# Altium schematic sheet Teensywpinsfinal.SchDoc
size C
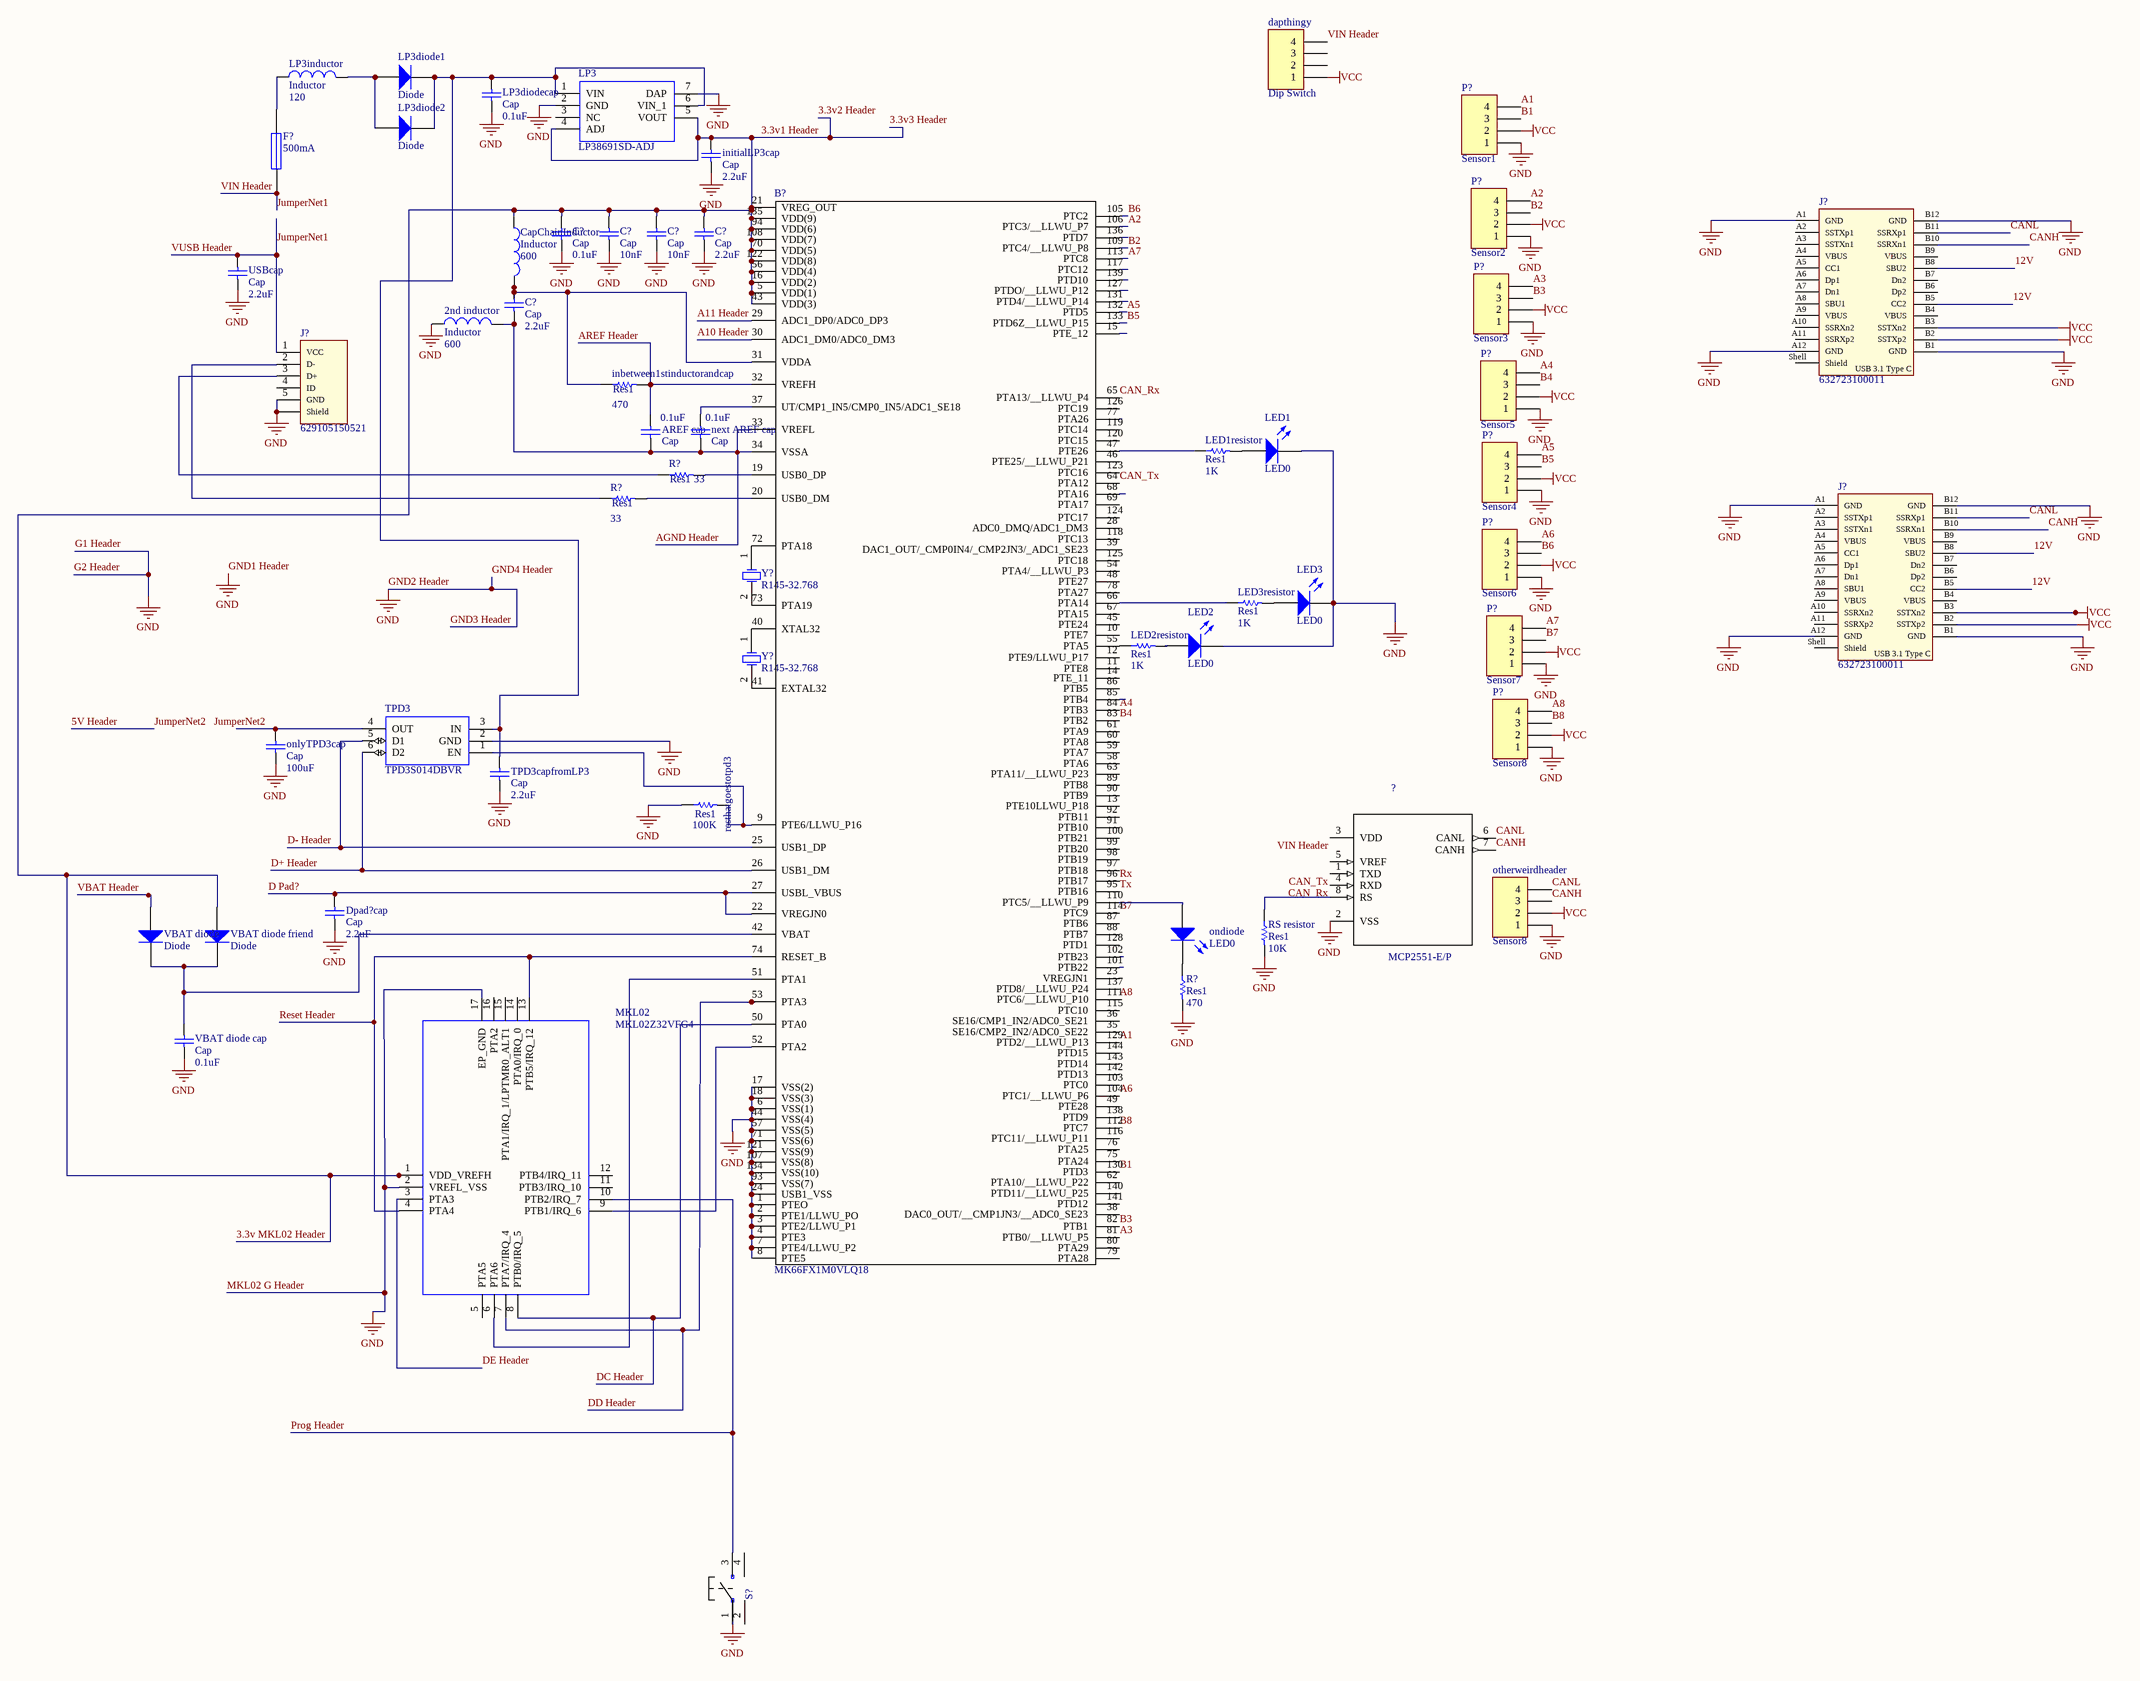
[diagram p0: Teensywpinsfinal.SchDoc]

## Parts
(Parts that share a designator on the sheet are numbered #1, #2 ... from top to bottom, then left to right.)
2nd_inductor  Inductor  value 600  [INDC5041X06N]
?  MCP2551-E/P  [SOIC127P600X175-8N]
AREF_cap  Cap  value 0.1uF  [CAPC2012X06N]
B?  MK66FX1M0VLQ18  [QFP50P2200X2200X160-144N]
C?#1  Cap  value 0.1uF  [CAPC2012X06N]
C?#2  Cap  value 10nF  [CAPC2012X06N]
C?#3  Cap  value 10nF  [CAPC2012X06N]
C?#4  Cap  value 2.2uF  [CAPC2012X06N]
C?#5  Cap  value 2.2uF  [CAPC2012X06N]
CapChainInductor  Inductor  value 600  [INDC5041X06N]
dapthingy  Dip Switch  [SOP254P1020X947-4N]
Dpad?cap  Cap  value 2.2uF  [CAPC2012X06N]
F?  500mA  [CAPC1608X06N]
inbetween1stinductorandcap  Res1  value 470  [CAPC1005X06N]
initialLP3cap  Cap  value 2.2uF  [CAPC2012X06N]
J?#1  632723100011  [632723100011]
J?#2  629105150521  [629105150521]
J?#3  632723100011  [632723100011]
LED1  LED0  [0603]
LED1resistor  Res1  value 1K  [CAPC1005X04N]
LED2  LED0  [0603]
LED2resistor  Res1  value 1K  [CAPC1005X04N]
LED3  LED0  [0603]
LED3resistor  Res1  value 1K  [CAPC1005X04N]
LP3  LP38691SD-ADJ  [SON95P300X300X80-7N]
LP3diode1  Diode  [SODFL370X105-2N]
LP3diode2  Diode  [SODFL370X105-2N]
LP3diodecap  Cap  value 0.1uF  [CAPC2012X06N]
LP3inductor  Inductor  value 120  [CAPC1608X06N]
MKL02  MKL02Z32VFG4  [QFN50P300X300X65-17N-D]
next_AREF_cap  Cap  value 0.1uF  [CAPC2012X06N]
ondiode  LED0  [0603]
onlyTPD3cap  Cap  value 100uF  [CAPC2012X06N]
otherweirdheader  Sensor8  [HDR1X4]
P?#1  Sensor1  [HDR1X4]
P?#2  Sensor2  [HDR1X4]
P?#3  Sensor3  [HDR1X4]
P?#4  Sensor5  [HDR1X4]
P?#5  Sensor4  [HDR1X4]
P?#6  Sensor6  [HDR1X4]
P?#7  Sensor7  [HDR1X4]
P?#8  Sensor8  [HDR1X4]
R?#1  Res1  value 33  [CAPC1005X06N]
R?#2  Res1  value 33  [CAPC1005X06N]
R?#3  Res1  value 470  [CAPC1005X06N]
resthatgoestotpd3  Res1  value 100K  [CAPC1005X06N]
RS_resistor  Res1  value 10K  [CAPC1005X04N]
S?  TL3315NF100Q  [TL3315NF100Q]  (value not drawn)
TPD3  TPD3S014DBVR  [SOT95P280X145-6N]
TPD3capfromLP3  Cap  value 2.2uF  [CAPC2012X06N]
USBcap  Cap  value 2.2uF  [CAPC2012X06N]
VBAT_diode  Diode  [SODFL370X105-2N]
VBAT_diode_cap  Cap  value 0.1uF  [CAPC2012X06N]
VBAT_diode_friend  Diode  [SODFL370X105-2N]
Y?#1  R145-32.768  [R145]
Y?#2  R145-32.768  [R145]

## Nets
G1 Header: 2nd_inductor.1 ?.2(VSS) B?.1(PTEO) B?.2(PTE1/LLWU_PO) B?.3(PTE2/LLWU_P1) B?.4(PTE3) B?.6(VSS(1)) B?.7(PTE4/LLWU_P2) B?.8(PTE5) B?.17(VSS(2)) B?.18(VSS(3)) B?.24(USB1_VSS) B?.44(VSS(4)) B?.57(VSS(5)) B?.71(VSS(6)) B?.93(VSS(7)) B?.107(VSS(8)) B?.121(VSS(9)) B?.134(VSS(10)) C?#1.2 C?#2.2 C?#3.2 C?#4.2 Dpad?cap.2 initialLP3cap.2 J?#1.A1(GND) J?#1.A12(GND) J?#1.B1(GND) J?#1.B12(GND) J?#2.5(GND) J?#2.Shell(Shield) J?#3.A1(GND) J?#3.A12(GND) J?#3.B1(GND) J?#3.B12(GND) LED1.2(K) LED2.2(K) LED3.2(K) LP3.2(GND) LP3.7(DAP) LP3diodecap.2 MKL02.2(VREFL_VSS) MKL02.17(EP_GND) onlyTPD3cap.2 otherweirdheader.1 P?#1.1 P?#2.1 P?#3.1 P?#4.1 P?#5.1 P?#6.1 P?#7.1 P?#8.1 R?#3.2 resthatgoestotpd3.1 RS_resistor.2 S?.1(P$1) TPD3.2(GND) TPD3capfromLP3.2 USBcap.2 VBAT_diode_cap.2  [also labelled G2 Header, GND, GND1 Header, GND2 Header, GND3 Header, GND4 Header, MKL02 G Header]
VCC: dapthingy.1 J?#1.B2(SSTXp2) J?#1.B3(SSTXn2) J?#3.B2(SSTXp2) J?#3.B3(SSTXn2) otherweirdheader.2 P?#1.2 P?#2.2 P?#3.2 P?#4.2 P?#5.2 P?#6.2 P?#7.2 P?#8.2
3.3v MKL02 Header: B?.5(VDD(1)) B?.16(VDD(2)) B?.21(VREG_OUT) B?.43(VDD(3)) B?.56(VDD(4)) B?.70(VDD(5)) B?.94(VDD(6)) B?.108(VDD(7)) B?.122(VDD(8)) B?.135(VDD(9)) C?#1.1 C?#2.1 C?#3.1 C?#4.1 CapChainInductor.1 initialLP3cap.1 LP3.4(ADJ) LP3.5(VOUT) MKL02.1(VDD_VREFH) VBAT_diode_friend.1(A)  [also labelled 3.3v1 Header, 3.3v2 Header, 3.3v3 Header]
12V: J?#1.B5(CC2) J?#1.B8(SBU2) J?#3.B5(CC2) J?#3.B8(SBU2)
A1: B?.129(PTD2/__LLWU_P13) P?#1.4
A2: B?.106(PTC3/__LLWU_P7) P?#2.4
A3: B?.81(PTB0/__LLWU_P5) P?#3.4
A4: B?.84(PTB3) P?#4.4
A5: B?.132(PTD5) P?#5.4
A6: B?.104(PTC1/__LLWU_P6) P?#6.4
A7: B?.113(PTC8) P?#7.4
A8: B?.111(PTC6/__LLWU_P10) P?#8.4
A10 Header: B?.30(ADC1_DM0/ADC0_DM3)
A11 Header: B?.29(ADC1_DP0/ADC0_DP3)
AGND Header: 2nd_inductor.2 AREF_cap.2 B?.33(VREFL) B?.34(VSSA) C?#5.2 next_AREF_cap.2
AREF Header: AREF_cap.1 B?.32(VREFH) inbetween1stinductorandcap.2
B1: B?.130(PTD3) P?#1.3
B2: B?.109(PTC4/__LLWU_P8) P?#2.3
B3: B?.82(PTB1) P?#3.3
B4: B?.83(PTB2) P?#4.3
B5: B?.133(PTD6Z__LLWU_P15) P?#5.3
B6: B?.105(PTC2) P?#6.3
B7: B?.114(PTC9) P?#7.3
B8: B?.112(PTC7) P?#8.3
CAN_Rx: ?.4(RXD) B?.65(PTA13/__LLWU_P4)
CAN_Tx: ?.1(TXD) B?.64(PTA12)
CANH: ?.7(CANH) J?#1.B10(SSRXn1) J?#3.B10(SSRXn1) otherweirdheader.3
CANL: ?.6(CANL) J?#1.B11(SSRXp1) J?#3.B11(SSRXp1) otherweirdheader.4
D Pad?: B?.22(VREGJN0) B?.27(USBL_VBUS) Dpad?cap.1
D+ Header: B?.26(USB1_DM) TPD3.6(D2)
D- Header: B?.25(USB1_DP) TPD3.5(D1)
DC Header: B?.50(PTA0) MKL02.8(PTB0/IRQ_5)
DD Header: B?.53(PTA3) MKL02.7(PTA7/IRQ_4)
DE Header: MKL02.3(PTA3)
JumperNet1: ?.3(VDD) dapthingy.4 F?.1 J?#2.1(VCC) USBcap.1  [also labelled VIN Header, VUSB Header]
Prog Header: MKL02.10(PTB2/IRQ_7) S?.3(P$2)
Reset Header: B?.74(RESET_B) MKL02.4(PTA4) MKL02.13(PTB5/IRQ_12)
Rx: B?.96(PTB17)
Tx: B?.95(PTB16)
VBAT Header: VBAT_diode.1(A)
Net?_8: ?.8(RS) RS_resistor.1
NetB?_9: B?.9(PTE6/LLWU_P16) resthatgoestotpd3.2 TPD3.1(EN)
NetB?_19: B?.19(USB0_DP) R?#1.2
NetB?_20: B?.20(USB0_DM) R?#2.2
NetB?_31: B?.31(VDDA) C?#5.1 CapChainInductor.2 inbetween1stinductorandcap.1
NetB?_37: B?.37(UT/CMP1_IN5/CMP0_IN5/ADC1_SE18) next_AREF_cap.1
NetB?_40: B?.40(XTAL32) Y?#2.1(OSC1)
NetB?_41: B?.41(EXTAL32) Y?#2.2(OSC2)
NetB?_42: B?.42(VBAT) VBAT_diode.2(K) VBAT_diode_cap.1 VBAT_diode_friend.2(K)
NetB?_47: B?.47(PTE26) LED1resistor.1
NetB?_51: B?.51(PTA1) MKL02.6(PTA6)
NetB?_52: B?.52(PTA2) MKL02.9(PTB1/IRQ_6)
NetB?_55: B?.55(PTA5) LED2resistor.1
NetB?_66: B?.66(PTA14) LED3resistor.1
NetB?_72: B?.72(PTA18) Y?#1.1(OSC1)
NetB?_73: B?.73(PTA19) Y?#1.2(OSC2)
NetB?_110: B?.110(PTC5/__LLWU_P9) ondiode.1(A)
NetF?_2: F?.2 LP3inductor.1
NetJ?#2_2: J?#2.2(D-) R?#2.1
NetJ?#2_3: J?#2.3(D+) R?#1.1
NetLED1_1: LED1.1(A) LED1resistor.2
NetLED2_1: LED2.1(A) LED2resistor.2
NetLED3_1: LED3.1(A) LED3resistor.2
NetLP3_1: LP3.1(VIN) LP3.6(VIN_1) LP3diode1.2(K) LP3diode2.2(K) LP3diodecap.1 TPD3.3(IN) TPD3capfromLP3.1
NetLP3diode1_1: LP3diode1.1(A) LP3diode2.1(A) LP3inductor.2
Netondiode_2: ondiode.2(K) R?#3.1
NetonlyTPD3cap_1: onlyTPD3cap.1 TPD3.4(OUT)

Not connected (* = marked no-connect by the designer): ? 5(VREF); B? 10(PTE7) 11(PTE8) 12(PTE9/LLWU_P17) 13(PTE10LLWU_P18) 14(PTE_11) 15(PTE_12) 23(VREGJN1) 28(ADC0_DMQ/ADC1_DM3) 35(SE16/CMP2_IN2/ADC0_SE22) 36(SE16/CMP1_IN2/ADC0_SE21) 38(DAC0_OUT/__CMP1JN3/__ADC0_SE23) 39(DAC1_OUT/_CMP0IN4/_CMP2JN3/_ADC1_SE23) 45(PTE24) 46(PTE25/__LLWU_P21) 48(PTE27) 49(PTE28) 54(PTA4/__LLWU_P3) 58(PTA6) 59(PTA7) 60(PTA8) 61(PTA9) 62(PTA10/__LLWU_P22) 63(PTA11/__LLWU_P23) 67(PTA15) 68(PTA16) 69(PTA17) 75(PTA24) 76(PTA25) 77(PTA26) 78(PTA27) 79(PTA28) 80(PTA29) 85(PTB4) 86(PTB5) 87(PTB6) 88(PTB7) 89(PTB8) 90(PTB9) 91(PTB10) 92(PTB11) 97(PTB18) 98(PTB19) 99(PTB20) 100(PTB21) 101(PTB22) 102(PTB23) 103(PTC0) 115(PTC10) 116(PTC11/__LLWU_P11) 117(PTC12) 118(PTC13) 119(PTC14) 120(PTC15) 123(PTC16) 124(PTC17) 125(PTC18) 126(PTC19) 127(PTDO/__LLWU_P12) 128(PTD1) 131(PTD4/__LLWU_P14) 136(PTD7) 137(PTD8/__LLWU_P24) 138(PTD9) 139(PTD10) 140(PTD11/__LLWU_P25) 141(PTD12) 142(PTD13) 143(PTD14) 144(PTD15); dapthingy 2 3; J?#1 A2(SSTXp1) A3(SSTXn1) A4(VBUS) A5(CC1) A6(Dp1) A7(Dn1) A8(SBU1) A9(VBUS) A10(SSRXn2) A11(SSRXp2) B4(VBUS) B6(Dp2) B7(Dn2) B9(VBUS) Shell(Shield); J?#2 4(ID); J?#3 A2(SSTXp1) A3(SSTXn1) A4(VBUS) A5(CC1) A6(Dp1) A7(Dn1) A8(SBU1) A9(VBUS) A10(SSRXn2) A11(SSRXp2) B4(VBUS) B6(Dp2) B7(Dn2) B9(VBUS) Shell(Shield); LP3 3(NC); MKL02 5(PTA5) 11(PTB3/IRQ_10) 12(PTB4/IRQ_11) 14(PTA0/IRQ_0) 15(PTA1/IRQ_1/LPTMR0_ALT1) 16(PTA2); S? 2(P$1) 4(P$2)

## Notes on the sheet
- Labels drawn without touching a wire or pin: JumperNet2
- (in symbol 632723100011) USB 3.1 Type C

## Library data of the parts
2nd_inductor CapChainInductor LP3inductor = Inductor: Code_IEC: 1005; Published: 8-Jun-2000; LatestRevisionDate: 29-May-2009; LatestRevisionNote: IPC-7351 Footprint Added.; PackageReference: 0402-A; Publisher: Altium Limited; PackageDescription: Chip Inductor; Code_JEITA: 0402
? = MCP2551-E/P: IC TRANSCEIVER CAN HI-SPD 8-DIP; MF: Microchip; Package: DIP-8 Microchip; MP: MCP2551-E/P; Availability: Good; Price: 1.03 USD; Value: *
AREF_cap C?#1-C?#5 Dpad?cap initialLP3cap LP3diodecap next_AREF_cap onlyTPD3cap TPD3capfromLP3 USBcap VBAT_diode_cap = Cap: Capacitor; Published: 8-Jun-2000; LatestRevisionDate: 17-Jul-2002; LatestRevisionNote: Re-released for DXP Platform.; PackageReference: RAD-0.3; Publisher: Altium Limited; PackageDescription: Radial Cap, Thru-Hole; 2 Leads; 0.3 in Pin Spacing
B? = MK66FX1M0VLQ18: NXP - MK66FX1M0VLQ18 - MPU, ARM CORTEX-M4F, 180MHZ, LQFP-144; Manufacturer_Name: Nexperia; Geometry.Height: 1.6mm; Supplier_Name: RS; RS Part Number: *; Manufacturer_Part_Number: MK66FX1M0VLQ18; Allied_Number: *; Other Part Number: *; Datasheet Link: https://cache.nxp.com/docs/en/data-sheet/K66P144M180SF5V2.pdf; 3D Package: *
dapthingy otherweirdheader P?#1-P?#8 = Header 4: Header, 4-Pin; LatestRevisionDate: 17-Jul-2002; LatestRevisionNote: Re-released for DXP Platform.; Publisher: Altium Limited
F? = Fuse 1: Fuse; Published: 8-Jun-2000; LatestRevisionDate: 17-Jul-2002; LatestRevisionNote: Re-released for DXP Platform.; PackageReference: PIN-W2/E2.8; Publisher: Altium Limited; PackageDescription: Thru-Hole; 2 Leads
inbetween1stinductorandcap LED1resistor LED2resistor LED3resistor R?#1-R?#3 resthatgoestotpd3 RS_resistor = Res1: Resistor; Published: 8-Jun-2000; LatestRevisionDate: 17-Jul-2002; LatestRevisionNote: Re-released for DXP Platform.; PackageReference: AXIAL-0.3; Publisher: Altium Limited; PackageDescription: Axial Device, Thru-Hole; 2 Leads; 0.3 in Pin Spacing
J?#1 J?#3 = 632723100011: USB 3.1 Type C Receptacle Horizontal THR WR-COM; Interface Type: Type C; Sub-Family: USB 3.1; ComponentLink1Description: Manufacturer; ComponentLink1URL: http://www.we-online.de; ComponentLink2Description: Datasheet; ComponentLink2URL: http://katalog.we-online.de/em/datasheet/632723x00011.pdf; Part Number: 632723100011; Published Date: April 2017; Publisher: Wurth Elektronik; Gender: Receptacle; Type: Horizontal; Construction: THR
J?#2 = 629105150521: Micro USB 2.0 SMT Type B Horizontal 5 Contacts High Current WR-COM; Interface Type: Type B; Gender: Receptacle; ComponentLink1Description: Manufacturer; ComponentLink1URL: http://www.we-online.de; ComponentLink2Description: Datasheet; ComponentLink2URL: http://katalog.we-online.de/em/datasheet/629105150521.pdf; Part Number: 629105150521; Published Date: April 2017; Publisher: Wurth Elektronik; Sub-Family: Micro USB 2.0; Type: Horizontal; Construction: SMT
LED1-LED3 ondiode = LED0: Typical INFRARED GaAs LED; Published: 8-Jun-2000; LatestRevisionDate: 08-Jul-2005; LatestRevisionNote: Mech Layer 1 removed.; PackageReference: LED-0; Publisher: Altium Limited; PackageDescription: LED; 2 Leads
LP3 = LP38691SD-ADJ: 500mA LDO Regulator Adj.,LP38691SD-ADJ; Manufacturer_Name: Texas Instruments; Geometry.Height: 0.8mm; Supplier_Name: Mouser; Mouser Part Number: 926-LP38691SD-ADJ; Manufacturer_Part_Number: LP38691SD-ADJ; Datasheet Link: http://www.ti.com/lit/ds/symlink/lp38691-adj.pdf; 3D Package: *
LP3diode1 LP3diode2 VBAT_diode VBAT_diode_friend = Diode: Default Diode; Published: 8-Jun-2000; LatestRevisionDate: 17-Jul-2002; LatestRevisionNote: Re-released for DXP Platform.; PackageVersion: Sep-1996; PackageReference: SMC; Publisher: Altium Limited; PackageDescription: DO-214-AB/SMC; 2 C-Bend Leads; Body 7.9 x 5.9 mm, inc. leads (LxW); Code_JEDEC: DO-214-AB
MKL02 = MKL02Z32VFG4: Freescale MKL02Z32VFG4, 32bit ARM Cortex M0 Microcontroller, 48MHz, 32 kB Flash, 16-Pin QFN; Manufacturer_Name: Nexperia; Geometry.Height: 0.65mm; Supplier_Name: RS; RS Part Number: 7884723; Manufacturer_Part_Number: MKL02Z32VFG4; Allied_Number: *; Other Part Number: *; Datasheet Link: http://cache.nxp.com/files/32bit/doc/data_sheet/KL02P32M48SF0.pdf; 3D Package: *
S? = TL3315NF100Q: SWITCH TACTILE SPST-NO 0.05A 15V; MF: E-Switch; Package: None; Availability: Good; Price: 0.13 USD; MP: TL3315NF100Q; Value: *
TPD3 = TPD3S014DBVR: Current Limit Load Sw & TVS 0.5A SOT23-6 Texas Instruments TPD3S014DBVR Load Switch IC, Current Limit Switch, 4.5  5.5V, 6-Pin, SOT-23; Geometry.Height: 1.45mm; Supplier_Name: RS; RS Part Number: 9009703P; Manufacturer_Name: Texas Instruments; Manufacturer_Part_Number: TPD3S014DBVR; Allied_Number: *; Other Part Number: *; Datasheet Link: http://www.ti.com/lit/ds/symlink/tpd3s044.pdf; 3D Package: *
Y?#1 Y?#2 = R145-32.768: Tuning Fork Crystal Unit; Published: 8-Jun-2000; LatestRevisionDate: 17-Jul-2002; LatestRevisionNote: Re-released for DXP Platform.; DatasheetDocument: 28-Sep-1998; PackageReference: R145; Publisher: Altium Limited; ComponentLink1Description: Manufacturer Link; ComponentLink1URL: http://www.raltron.com/products/microcrystals/default.asp; ComponentLink2Description: Datasheet; ComponentLink2URL: http://www.raltron.com/products/pdfspecs/crystal_r38_26_145.pdf